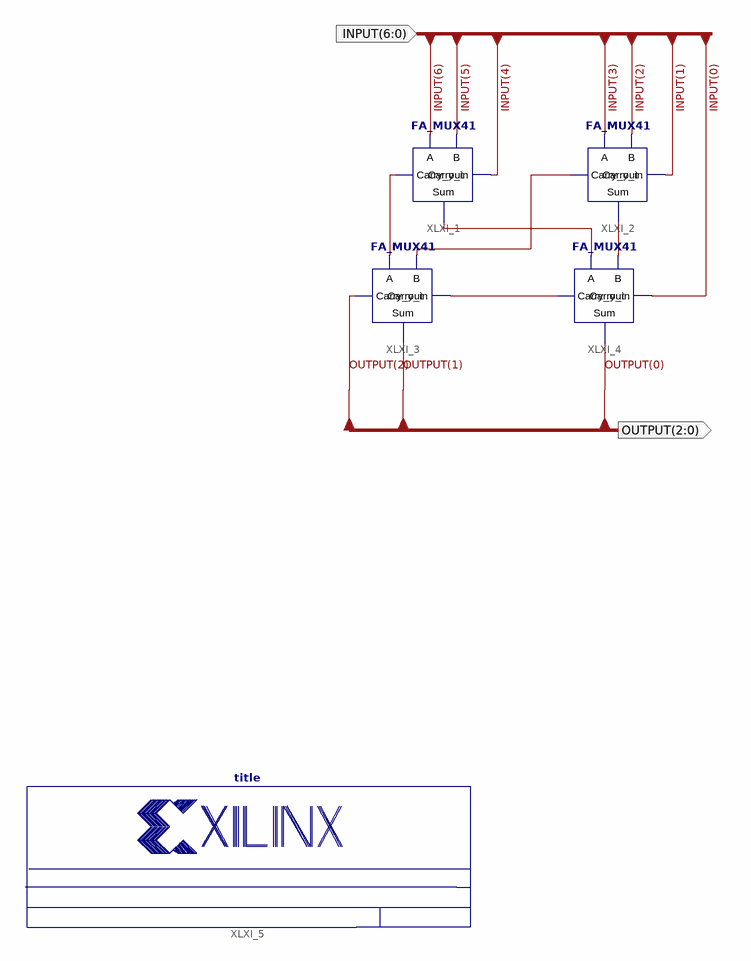
[diagram p0: schematic sheet 1]
// Xilinx ISE schematic FA_COUNT_NUMBER_ONE.sch (spartan3e) as structural Verilog: 5 symbols, 2 ports
module FA_COUNT_NUMBER_ONE (
  input  [6:0] INPUT,
  output [2:0] OUTPUT
);

  wire XLXN_7, XLXN_8, XLXN_10, XLXN_11, XLXN_13;

  FA_MUX41 XLXI_1 (.A(INPUT[6]), .B(INPUT[5]), .Carry_out(XLXN_10), .Carry_in(INPUT[4]), .Sum(XLXN_7));
  FA_MUX41 XLXI_2 (.A(INPUT[3]), .B(INPUT[2]), .Carry_out(XLXN_11), .Carry_in(INPUT[1]), .Sum(XLXN_8));
  FA_MUX41 XLXI_3 (.A(XLXN_10), .B(XLXN_11), .Carry_out(OUTPUT[2]), .Carry_in(XLXN_13), .Sum(OUTPUT[1]));
  FA_MUX41 XLXI_4 (.A(XLXN_7), .B(XLXN_8), .Carry_out(XLXN_13), .Carry_in(INPUT[0]), .Sum(OUTPUT[0]));
  title #(.NameFieldText("Karthik Vippala")) XLXI_5 ();
endmodule
